# EAGLE design micromouse (EAGLE 7.1.0)
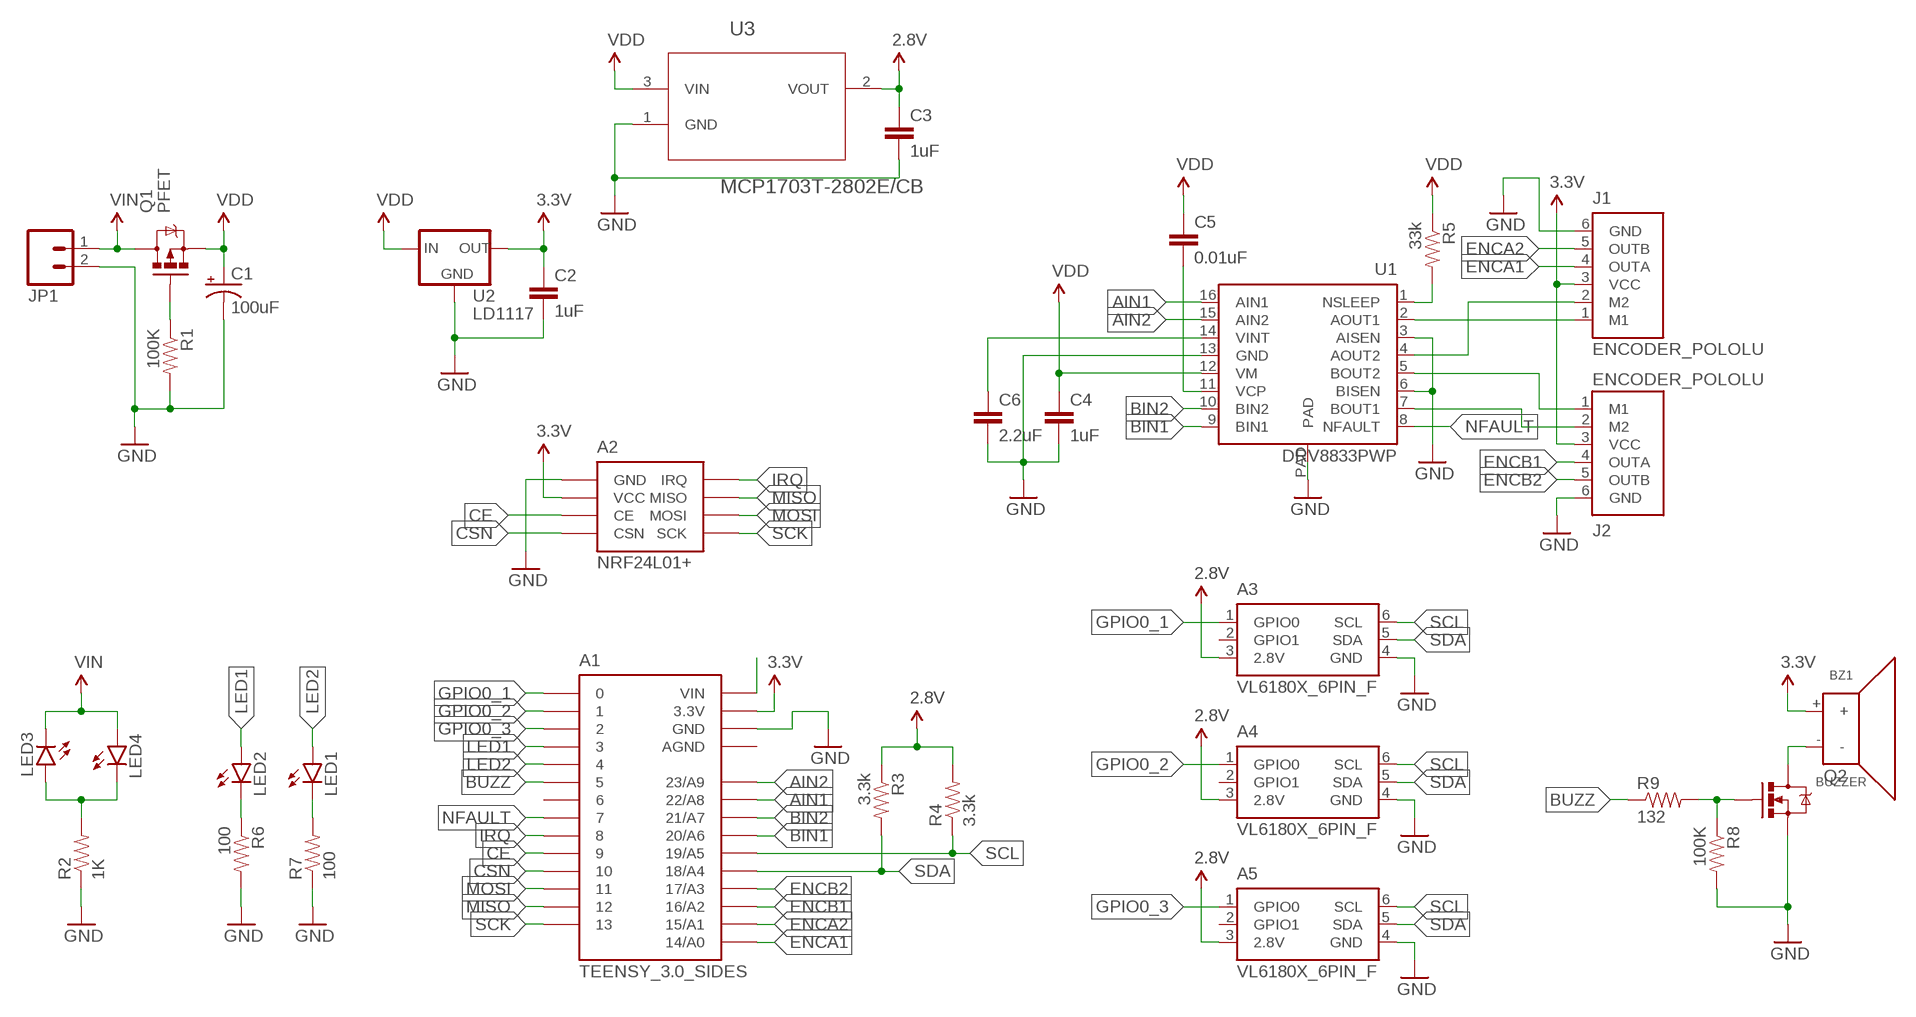
[diagram p0: schematic, sheet 1]

## Parts
A1  TEENSY_3.0_SIDES  [TEENSY_3.0_SIDES]
A2  NRF24L01+  [NRF24L01+]
A3  VL6180X_6PIN_F  [2X3HEADER]
A4  VL6180X_6PIN_F  [2X3HEADER]
A5  VL6180X_6PIN_F  [2X3HEADER]
BZ1  BUZZER  [BUZZER]
C1  100uF  CAP_POLPTH1  [CPOL-RADIAL-100UF-25V]
C2  1uF  CAP0603-CAP  [0603-CAP]
C3  1uF  CAP0603-CAP  [0603-CAP]
C4  1uF  CAP0603-CAP  [0603-CAP]
C5  0.01uF  CAP0603-CAP  [0603-CAP]
C6  2.2uF  CAP0603-CAP  [0603-CAP]
J1  ENCODER_POLOLU  [1XM06-LOCK]
J2  ENCODER_POLOLU  [1XM06-LOCK]
JP1  M02LOCK_LONGPADS  [1X02_LOCK_LONGPADS]
LED1  LED0603  [LED-0603]
LED2  LED0603  [LED-0603]
LED3  LED0603  [LED-0603]
LED4  LED0603  [LED-0603]
Q1  PFET  MOSFET-PCHANNEL  [SOT23-3]
Q2  MOSFET-NCHANNELBSS123LT1G  [SOT23-3]
R1  100K  RESISTOR0603  [0603-RES]
R2  1K  RESISTOR0603  [0603-RES]
R3  3.3k  RESISTOR0603  [0603-RES]
R4  3.3k  RESISTOR0603  [0603-RES]
R5  33k  RESISTOR0603  [0603-RES]
R6  100  RESISTOR0603  [0603-RES]
R7  100  RESISTOR0603  [0603-RES]
R8  100K  RESISTOR0603  [0603-RES]
R9  132  RESISTOR0603  [0603-RES]
U1  DRV8833PWP  [HTSSOP-16]
U2  LD1117  [SOT-223]
U3  MCP1703T-2802E/CB  MCP1703T-3002E/CB  [SOT95P300X145-3N]

## Nets
2.8V: A3.3(2.8V) A4.3(2.8V) A5.3(2.8V) C3.1 R3.1 R4.2 U3.2(VOUT)
3.3V: A1.3.3V A2.2(VCC) BZ1.+ C2.1 J1.3(VCC) J2.3(VCC) U2.2(OUT) U2.4(OUT)
AIN1: A1.22/A8 U1.16(AIN1)
AIN2: A1.23/A9 U1.15(AIN2)
BIN1: A1.20/A6 U1.9(BIN1)
BIN2: A1.21/A7 U1.10(BIN2)
BUZZ: A1.5 R9.1
CE: A1.9 A2.3(CE)
CSN: A1.10 A2.4(CSN)
ENCA1: A1.14/A0 J1.4(OUTA)
ENCA2: A1.15/A1 J1.5(OUTB)
ENCB1: A1.16/A2 J2.4(OUTA)
ENCB2: A1.17/A3 J2.5(OUTB)
GND: A1.GND A2.1(GND) A3.4(GND) A4.4(GND) A5.4(GND) C1.2(-) C2.2 C3.2 C4.2 C6.2 J1.6(GND) J2.6(GND) JP1.2 Q2.2(S) R1.2 R2.1 R6.2 R7.1 R8.2 U1.3(AISEN) U1.6(BISEN) U1.13(GND) U1.PAD U2.1(GND) U3.1(GND)
GPIO0_1: A1.0 A3.1(GPIO0)
GPIO0_2: A1.1 A4.1(GPIO0)
GPIO0_3: A1.2 A5.1(GPIO0)
IRQ: A1.8 A2.8(IRQ)
LED1: A1.3 LED2.A
LED2: A1.4 LED1.A
MISO: A1.12 A2.7(MISO)
MOSI: A1.11 A2.6(MOSI)
N$1: Q1.1(G) R1.1
N$2: LED3.A LED4.C R2.2
N$3: J1.1(M1) U1.2(AOUT1)
N$4: A1.VIN
N$5: LED2.C R6.1
N$6: J1.2(M2) U1.4(AOUT2)
N$7: J2.1(M1) U1.5(BOUT2)
N$8: BZ1.- Q2.3(D)
N$9: J2.2(M2) U1.7(BOUT1)
N$10: R5.2 U1.1(NSLEEP)
N$11: C6.1 U1.14(VINT)
N$12: C5.2 U1.11(VCP)
N$13: LED1.C R7.2
N$15: Q2.1(G) R8.1 R9.2
NFAULT: A1.7 U1.8(NFAULT)
SCK: A1.13 A2.5(SCK)
SCL: A1.19/A5 A3.6(SCL) A4.6(SCL) A5.6(SCL) R4.1
SDA: A1.18/A4 A3.5(SDA) A4.5(SDA) A5.5(SDA) R3.2
VDD: C1.1(+) C4.1 C5.1 Q1.2(S) R5.1 U1.12(VM) U2.3(IN) U3.3(VIN)
VIN: JP1.1 LED3.C LED4.A Q1.3(D)
Unconnected: A1.6 A3.2(GPIO1) A4.2(GPIO1) A5.2(GPIO1)

## Power pins joined to a net without a drawn wire
AGND: A1.AGND

## Library data of the parts
A1 = Teensy3.0:TEENSY_3.0_SIDES
A2 = Custom:NRF24L01+: 2.4 GHz Radio Module
A3-A5 = Nick'sEagle:VL6180X_6PIN_F
BZ1 = Custom:BUZZER
C1 = SparkFun-Capacitors:CAP_POL: Capacitor Polarized These are standard SMD and PTH capacitors. Normally 10uF, 47uF, and 100uF in electrolytic and tantalum varieties. Always verify the external diameter of the through hole cap, it varies with capacity, voltage, and manufacturer. The EIA devices should be standard.
C2-C6 = SparkFun-Capacitors:CAP: Capacitor Standard 0603 ceramic capacitor, and 0.1" leaded capacitor.
J1 J2 = Custom:ENCODER_POLOLU
JP1 = SparkFun-Connectors:M02: Standard 2-pin 0.1" header. Use with - straight break away headers ( PRT-00116) - right angle break away headers (PRT-00553) - swiss pins (PRT-00743) - machine pins (PRT-00117) - female headers (PRT-00115) Molex polarized connector foot print use with: PRT-08233 with associated crimp pins and housings. 2.54_SCREWTERM for use with PRT-10571. 3.5mm Screw Terminal footprints for PRT-08084 5mm Screw Terminal footprints for use with PRT-08432
LED1-LED4 = SparkFun-LED:LED: LEDs Standard schematic elements and footprints for 5mm, 3mm, 1206, and 0603 sized LEDs. 5mm - Spark Fun Electronics SKU : COM-00529 (and others)
Q1 = SparkFun-DiscreteSemi:MOSFET-PCHANNEL: Generic PMOSFET IRLML2244 - TRANS-11153 (SOT-23 -20V -4.3A) (1.Gate 2.Source 3.Drain) FQP27P06 - COM-10349 <http://www.sparkfun.com/products/10349> (TO-220 -60V -27A) (1.Gate 2.Source 3.Drain); PROD_ID: TRANS-08285
Q2 = SparkFun-DiscreteSemi:MOSFET-NCHANNEL: Common NMOSFET Parts MFG P/N Store ID Prod ID FDD8780 TRANS-09984 SI7820DN TRANS-11055 FDS6630A IC-08089 2N7002PW TRANS-11151 FQP30N06L COM-10213 TRANS-10060 BSS123LT1G TRANS-08345 BSS138 TRANS-00830 BS170 2N7000; PROD_ID: TRANS-08345
R1-R9 = SparkFun-Resistors:RESISTOR: Resistor Basic schematic elements and footprints for 0603, 1206, and PTH resistors.
U1 = Custom:DRV8833PWP
U2 = Custom:LD1117: Low-Dropout Voltage Regulator
U3 = Microchip_By_element14_Batch_1:MCP1703T-3002E/CB: Low Quiescent Current LDO Regulator; MPN: MCP1703T-3002E/CB; OC_FARNELL: 1439517; OC_NEWARK: 40M0634; PACKAGE: SOT-3; SUPPLIER: Microchip

## Board
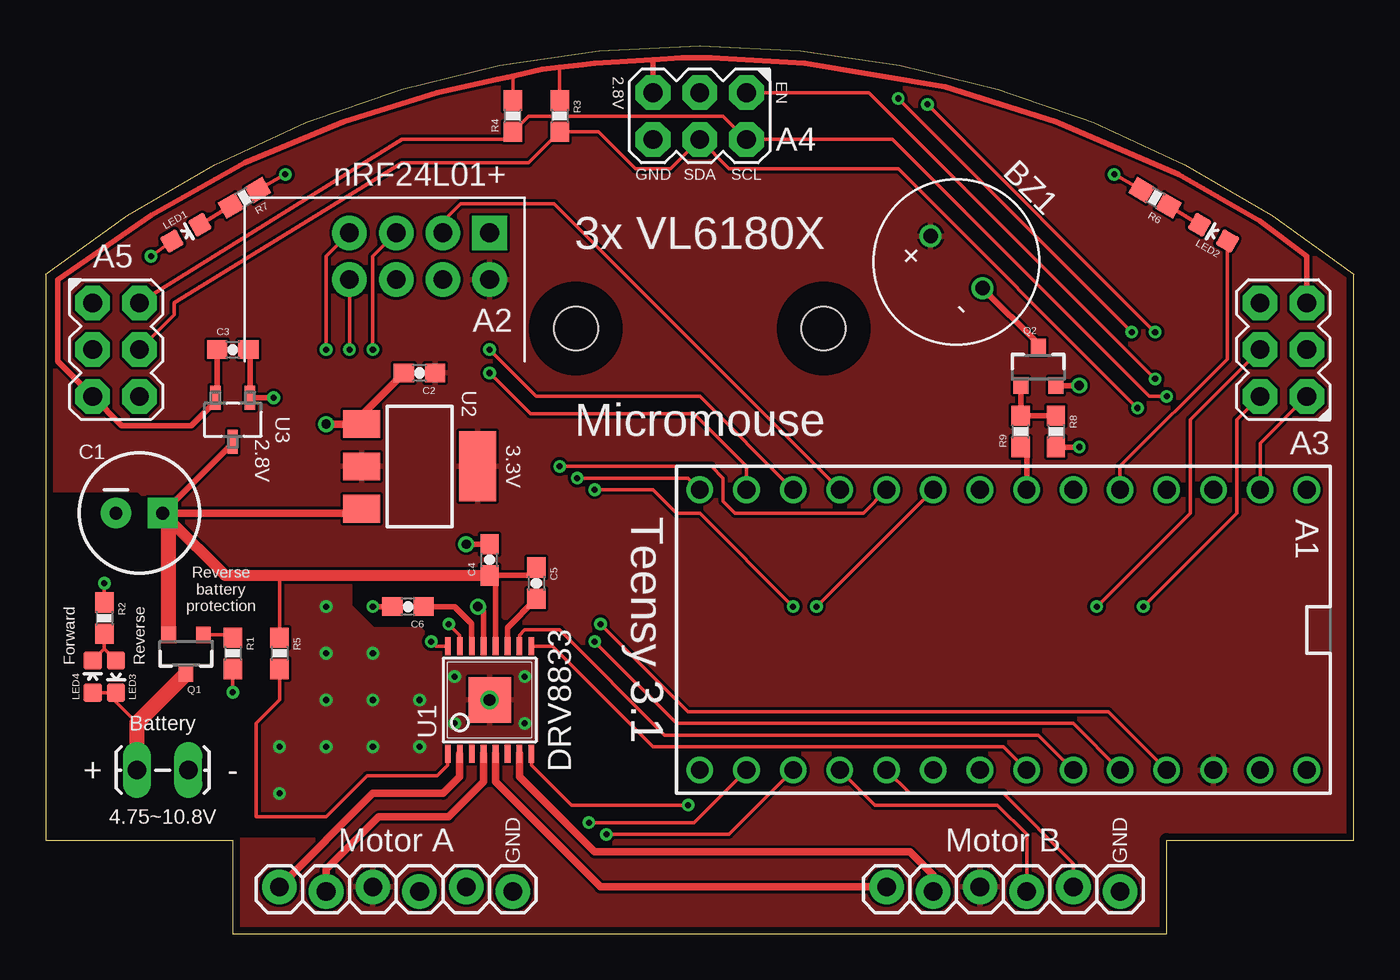
[diagram p1: board, top side]
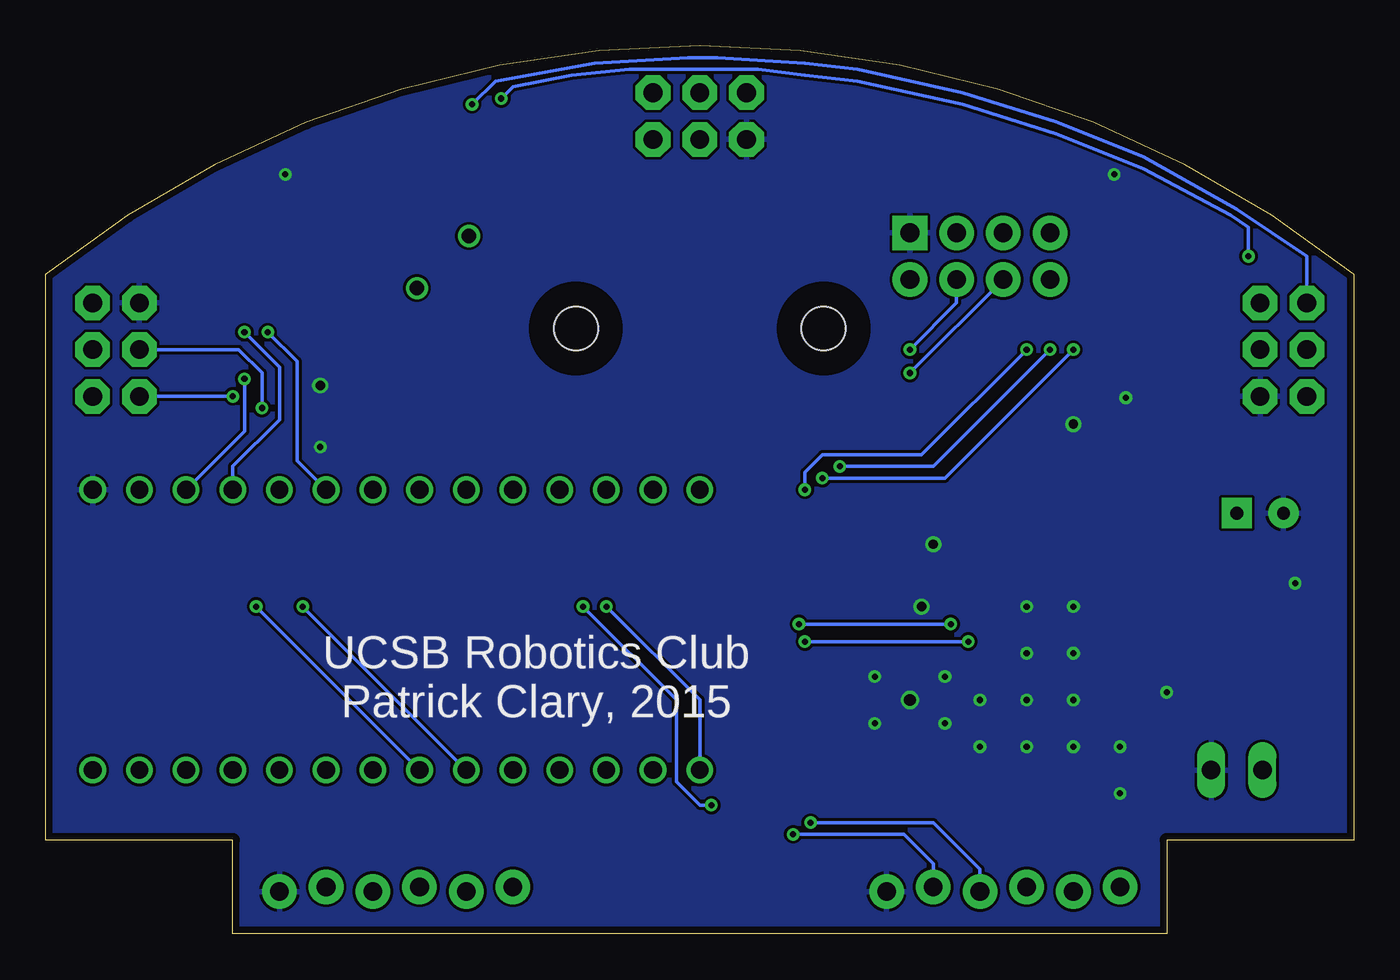
[diagram p2: board, bottom side, seen from below]

Size 71.12 x 48.26 mm. Coordinates in mm from the lower left corner, seen from the top.
Outline: 10.16,0 60.96,0 60.96,5.08 71.12,5.08 71.12,35.85 arc77 0,35.85 0,5.08 10.16,5.08 10.16,0
Copper layers (1*16): Top 0.0356mm / dielectric 1.5011mm / Bottom 0.0356mm
Design rules "LaenPCBOrder *": minimum track width 6mil, minimum drill 13mil, track to track 6mil, track to pad 6mil, pad to pad 6mil, via to via 6mil, smd to smd 6mil, copper to edge 15mil, drill to drill 6mil, minimum pad ring 7mil, minimum via ring 7mil, stop-mask expansion 3mil, vias tented up to drill 0mil, thermal gap 6mil
Holes 2.38 mm at 42.29,32.89 28.83,32.89
tRestrict: area 26.3,30.4 to 31.4,35.4; area 39.8,30.4 to 44.8,35.4
bRestrict: area 39.8,30.4 to 44.8,35.4; area 26.3,30.4 to 31.4,35.4

### Footprints (pad centres in the part's own frame; a part is rotated, then mirrored left to right if it is on the bottom)
TEENSY_3.0_SIDES = drill 0.965: 0 -7.62,13.97; 1 -7.62,11.43; 2 -7.62,8.89; 3 -7.62,6.35; 3.3V 7.62,11.43; 4 -7.62,3.81; 5 -7.62,1.27; 6 -7.62,-1.27; 7 -7.62,-3.81; 8 -7.62,-6.35; 9 -7.62,-8.89; 10 -7.62,-11.43; 11 -7.62,-13.97; 12 -7.62,-16.51; 13 7.62,-16.51; 14/A0 7.62,-13.97; 15/A1 7.62,-11.43; 16/A2 7.62,-8.89; 17/A3 7.62,-6.35; 18/A4 7.62,-3.81; 19/A5 7.62,-1.27; 20/A6 7.62,1.27; 21/A7 7.62,3.81; 22/A8 7.62,6.35; 23/A9 7.62,8.89; AGND 7.62,13.97; GND -7.62,16.51; VIN 7.62,16.51
NRF24L01+ = drill 1.016 pad 1.88 square: 1 -3.81,-1.27 | drill 1.016 pad 1.88: 2 -3.81,1.27; 3 -1.27,-1.27; 4 -1.27,1.27; 5 1.27,-1.27; 6 1.27,1.27; 7 3.81,-1.27; 8 3.81,1.27
2X3HEADER = drill 1.016 pad 1.88 octagon: 1 -1.27,2.54; 2 -1.27,0; 3 -1.27,-2.54; 4 1.27,-2.54; 5 1.27,0; 6 1.27,2.54
BUZZER = drill 0.8: + 2,0; - -2,0
CPOL-RADIAL-100UF-25V = drill 0.7 pad 1.651 square: 1 1.27,0 | drill 0.7 pad 1.651: 2 -1.27,0
0603-CAP = smd 1.1 x 1: 1 -0.85,0; 2 0.85,0
1XM06-LOCK = drill 1.016 pad 1.88: 1 0,0; 2 2.54,-0.254; 3 5.08,0; 4 7.62,-0.254; 5 10.16,0; 6 12.7,-0.254
1X02_LOCK_LONGPADS = drill 1.016 long: 1 -0.127,0; 2 2.667,0
LED-0603 = smd 1 x 1: A 0,-0.877; C 0,0.877
SOT23-3 = smd 0.8 x 0.9: 1 -0.95,-1; 2 0.95,-1; 3 0,1.1
0603-RES = smd 1.1 x 1: 1 -0.85,0; 2 0.85,0
HTSSOP-16 = smd 0.305 x 0.991: 1 -2.275,-2.918; 2 -1.625,-2.918; 3 -0.975,-2.918; 4 -0.325,-2.918; 5 0.325,-2.918; 6 0.975,-2.918; 7 1.625,-2.918; 8 2.275,-2.918; 9 2.275,2.918; 10 1.625,2.918; 11 0.975,2.918; 12 0.325,2.918; 13 -0.325,2.918; 14 -0.975,2.918; 15 -1.625,2.918; 16 -2.275,2.918 | smd 2.31 x 2.46: PAD 0,0
SOT-223 = smd 1.5 x 2: 1 -2.3,-3.15; 2 0,-3.15; 3 2.3,-3.15 | smd 3.8 x 2: 4 0,3.15
SOT95P300X145-3N = smd 0.559 x 1.321: 1 -0.94,-1.194; 2 0.94,-1.194; 3 0,1.194

### Placement (x,y rotation side)
A1  52.07,16.51 270 top
A2  20.32,36.83 180 top
A3  67.31,31.75 180 top
A4  35.56,44.45 270 top
A5  3.81,31.75 0 top
BZ1  49.53,36.51 135 top
C1  5.08,22.86 0 top
C2  20.32,30.48 180 top
C3  10.16,31.75 0 top
C4  24.13,20.32 90 top
C5  26.67,19.05 270 top
C6  19.68,17.78 180 top
J1  12.7,2.54 0 top
J2  45.72,2.54 0 top
JP1  5.08,8.89 0 top
LED1  7.62,38.1 300 top
LED2  63.5,38.1 60 top
LED3  3.81,13.97 180 top
LED4  2.54,13.97 0 top
Q1  7.62,15.24 180 top
Q2  53.98,30.8 0 top
R1  10.16,15.24 270 top
R2  3.17,17.14 270 top
R3  27.94,44.45 270 top
R4  25.4,44.45 90 top
R5  12.7,15.24 270 top
R6  60.33,40.01 150 top
R7  10.79,40.01 210 top
R8  54.93,27.3 270 top
R9  53.02,27.3 90 top
U1  24.13,12.7 0 top
U2  20.32,25.4 270 top
U3  10.16,27.94 180 top

### Tracks (layer width: path | path; a pad name or v marks a point on that pad's centre or on a via)
2.8V
  Top 0.203: 24.55,46.44 24.57,46.45 | 29.21,47.21 29.18,47.23 | R4.2 25.4,46.58 25.48,46.65 | R3.1 27.94,47.08
  Top 0.305: A3.3 68.58,36.83 66.04,38.73 61.59,41.27 54.93,44.13 48.9,46.04 41.27,47.31 36.2,47.62 34.61,47.62 32.98,47.52 | 27.93,47.09 26.99,46.99 25.48,46.65 25.11,46.57 24.57,46.45 21.27,45.72 16.19,44.13 10.79,41.91 5.71,39.05 0.64,35.56 0.64,31.11 A5.3 4.13,27.62 7.89,27.62 9.22,28.95 | 27.93,47.09 29.18,47.23 29.84,47.31 32.98,47.52 | A4.3 33.02,47.48 32.98,47.52 | 27.94,47.08 27.93,47.09 | 9.22,28.95 U3.2 | 9.22,28.95 9.31,29.04 C3.1
  Top 0.406: 9.16,31.6 C3.1
3.3V
  pour Top: 10.16,5.08 10.16,0 60.96,0 60.96,5.08 71.12,5.08 71.12,35.81 65.41,39.88 60.96,42.29 57.66,43.81 52.07,45.85 45.97,47.24 41.02,48.01 35.43,48.26 30.73,48.01 25.53,47.37 19.43,45.97 16,44.83 10.67,42.55 6.99,40.64 2.79,37.97 0,35.81 0,24.13 5.08,24.13 9.65,19.56 24.26,19.56 24.51,19.3 24.51,17.65 27.05,15.11 27.05,10.16 26.42,9.53 23.5,9.53 21.59,7.62 17.78,7.62 15.24,5.08
AIN1  (via drill 0.33)
  Top 0.203: U1.16 21.21,15.62 v20.95,15.88 | A1.22/A8 55.88,11.43 34.29,11.43 v29.84,15.88
  Bottom 0.203: v20.95,15.88 v29.84,15.88
AIN2  (via drill 0.33)
  Top 0.203: U1.15 22.5,16.23 v21.91,16.83 | A1.23/A9 57.78,12.06 34.92,12.06 v30.16,16.83
  Bottom 0.203: v21.91,16.83 v30.16,16.83
BIN1
  Top 0.203: A1.20/A6 52.07,10.16 33.02,10.16 27.56,15.62 U1.9
BIN2
  Top 0.203: U1.10 25.75,16.23 26.04,16.51 27.94,16.51 33.66,10.79 53.98,10.79 A1.21/A7
BUZZ
  Top 0.305: A1.5 53.34,26.14 R9.1
CE
  Top 0.203: A1.9 27.62,39.69 22.54,39.69 21.59,38.73 A2.3
CSN  (via drill 0.33)
  Top 0.203: A1.10 35.56,29.21 26.67,29.21 v24.13,31.75
  Bottom 0.203: v24.13,31.75 21.59,34.29 A2.4
ENCA1  (via drill 0.33)
  Top 0.203: A1.14/A0 35.24,6.03 v29.53,6.03
  Bottom 0.203: v29.53,6.03 22.86,6.03 20.32,3.49 J1.4
ENCA2  (via drill 0.33)
  Top 0.203: A1.15/A1 37.15,5.4 v30.48,5.4
  Bottom 0.203: v30.48,5.4 24.45,5.4 22.86,3.81 J1.5
ENCB1
  Top 0.203: A1.16/A2 45.09,6.99 51.75,6.99 53.34,5.4 J2.4
ENCB2
  Top 0.203: A1.17/A3 46.99,7.62 52.07,7.62 55.88,3.81 J2.5
GND  (via drill 0.33, 0.51, 0.64)
  Top 0.203: R1.2 v10.16,13.12 | R2.1 v3.17,19.05 | R6.2 v58.1,41.27 | R7.1 v13.02,41.27
  Top 0.305: C6.2 v17.78,17.78 | C4.2 v22.86,21.17 | U1.13 23.8,17.47 v23.5,17.78 | Q2.2 v56.2,29.8 | R8.2 v56.2,26.45 | 11.26,31.5 11.1,31.34 U3.1 v12.38,29.13
  Top 0.406: 23.16,11.72 U1.PAD 25.11,11.72 | C2.2 17.17,28.18 U2.1 v15.24,27.7 | 11.26,31.5 C3.2
  other vias: 24.13,12.7 15.24,17.78 15.24,15.24 17.78,15.24 20.32,12.7 20.32,10.16 17.78,10.16 17.78,12.7 15.24,12.7 15.24,10.16 12.7,10.16 12.7,7.62 26.04,13.97 22.23,13.97 26.04,11.43 22.23,11.43
  pour Bottom: 0,5.08 10.16,5.08 10.16,0 60.96,0 60.96,5.08 71.12,5.08 71.12,35.56 71.12,35.81 67.06,38.86 60.2,42.67 54.61,44.96 48.51,46.74 43.69,47.75 38.1,48.26 33.78,48.26 27.69,47.75 22.61,46.74 18.8,45.72 13.72,43.94 10.41,42.42 6.6,40.39 3.05,38.1 0.25,36.07 0,35.81
  pour Top: 26.67,10.16 21.91,10.16 21.91,9.21 21.27,8.57 17.46,8.57 15.24,6.35 11.43,6.35 11.43,11.43 12.7,12.7 12.7,19.05 16.51,19.05 16.51,17.78 17.78,16.51 20.32,16.51 21.59,15.24 26.35,15.24 26.67,14.92
GPIO0_1
  Top 0.203: A3.1 66.04,26.67 A1.0
GPIO0_2  (via drill 0.33)
  Top 0.203: v60.33,30.16 44.77,45.72 A4.1
  Bottom 0.203: A1.1 60.33,27.3 v60.33,30.16
GPIO0_3  (via drill 0.33)
  Top 0.203: v60.33,32.7 v47.94,45.09
  Bottom 0.203: A5.1 2.54,36.83 6.35,39.37 11.43,42.23 16.19,44.13 21.27,45.72 26.99,46.99 29.84,47.31 34.61,47.62 36.2,47.62 41.27,47.31 46.67,46.35 v47.94,45.09 | A1.2 60.96,25.4 58.42,27.94 58.42,30.8 v60.33,32.7
IRQ  (via drill 0.33)
  Top 0.203: A2.8 v16.51,31.75 | v27.94,25.4 36.2,25.4 36.83,24.77 36.83,23.5 37.47,22.86 44.45,22.86 A1.8
  Bottom 0.203: v16.51,31.75 22.86,25.4 v27.94,25.4
LED1
  Top 0.203: LED2.A 64.26,31.24 58.42,25.4 A1.3
LED2  (via drill 0.33)
  Top 0.203: LED1.A v5.71,36.83 | v59.05,32.7 v46.35,45.4
  Bottom 0.203: v5.71,36.83 5.71,38.42 6.67,39.05 11.43,41.59 16.19,43.5 21.27,45.09 26.99,46.35 29.84,46.67 32.38,46.99 39.37,46.99 42.55,46.67 45.72,46.04 v46.35,45.4 | v59.05,32.7 57.47,31.11 57.47,25.72 A1.4
MISO  (via drill 0.33)
  Top 0.203: v28.89,24.77 34.92,24.77 A1.12 | v15.24,31.75 15.24,36.83 A2.7
  Bottom 0.203: v15.24,31.75 22.23,24.77 v28.89,24.77
MOSI  (via drill 0.33)
  Top 0.203: A1.11 38.1,25.4 35.24,28.26 26.35,28.26 v24.13,30.48
  Bottom 0.203: v24.13,30.48 A2.6
N$1
  Top 0.203: Q1.1 10.01,16.24 R1.1
N$2
  Top 0.203: 3.17,15.48 LED4.C | LED3.A 3.17,15.48 | 3.17,15.48 R2.2
N$3
  Top 0.406: U1.2 22.5,8.54 21.59,7.62 17.78,7.62 J1.1
N$5
  Top 0.203: LED2.C R6.1
N$6
  Top 0.406: J1.2 15.24,3.49 18.1,6.35 21.91,6.35 23.8,8.25 U1.4
N$7
  Top 0.406: U1.5 24.45,8.25 30.16,2.54 J2.1
N$8
  Top 0.305: BZ1.- 53.98,32.07 Q2.3
N$9
  Top 0.406: U1.7 25.75,8.54 29.84,4.45 46.99,4.45 48.26,3.17 J2.2
N$10
  Top 0.203: R5.2 12.7,12.7 11.43,11.43 11.43,6.35 15.24,6.35 17.46,8.57 21.27,8.57 21.86,9.15 U1.1
N$11
  Top 0.305: C6.1 22.23,17.78 23.16,16.85 U1.14
N$12
  Top 0.305: U1.11 25.11,16.64 C5.2
N$13
  Top 0.203: LED1.C R7.2
N$15
  Top 0.305: Q2.1 R9.2 R8.1
NFAULT  (via drill 0.33)
  Top 0.203: A1.7 v41.91,17.78 | v34.92,6.99 28.57,6.99 26.41,9.15 U1.8
  Bottom 0.203: v41.91,17.78 36.83,12.7 36.83,8.26 35.56,6.99 v34.92,6.99
SCK  (via drill 0.33)
  Top 0.203: v40.64,17.78 35.56,22.86 34.29,22.86 33.02,24.13 v29.84,24.13 | v17.78,31.75 17.78,36.83 A2.5
  Bottom 0.203: A1.13 35.56,12.7 v40.64,17.78 | v29.84,24.13 29.84,25.08 28.89,26.04 23.5,26.04 v17.78,31.75
SCL  (via drill 0.33)
  Top 0.203: v59.69,17.78 64.77,22.86 64.77,27.94 A3.6 | v60.96,29.21 60.01,29.21 46.04,43.18 A4.6 36.83,44.45 26.25,44.45 R4.1 24.98,43.18 19.37,43.18 A5.6
  Bottom 0.203: A1.19/A5 v59.69,17.78 | v60.96,29.21 A3.6
SDA  (via drill 0.33)
  Top 0.203: v57.15,17.78 62.23,22.86 62.23,27.94 A3.5 | v59.37,28.57 46.35,41.59 37.15,41.59 A4.5 33.97,41.59 32.07,41.59 30.06,43.6 R3.2 26.25,41.91 19.37,41.91 6.99,34.29 6.99,33.66 A5.5
  Bottom 0.203: A1.18/A4 v57.15,17.78 | A3.5 60.64,31.75 59.37,30.48 v59.37,28.57
VDD
  Top 0.203: R5.1 12.7,19.47
  Top 0.305: U1.12 24.45,19.14 C4.1 26.24,19.47 C5.1 | C1.1 10.16,26.67 U3.3
  Top 0.406: U2.3 16.93,22.86 C1.1
  Top 0.61: 6.67,22.54 9.74,19.47 12.7,19.47 C4.1
  Top 0.813: Q1.2 6.67,22.54 C1.1
VIN
  Top 0.203: LED4.A LED3.C 3.81,12.57 4.95,11.43
  Top 0.813: JP1.1 4.95,11.43 4.95,11.47 Q1.3

### Text on the board
tPlace: 2.8V | EN | nRF24L01+ | GND | SDA | SCL | 3x VL6180X | Micromouse | 2.8V | 3.3V | Reverse / battery / protection | Teensy 3.1 | Forward | Reverse | DRV8833 | Battery | + | - | 4.75~10.8V | Motor A | GND | Motor B | GND
bPlace: UCSB Robotics Club / Patrick Clary, 2015